# EAGLE design Audio panel Embedded Mega breakout (EAGLE 9.6.2)
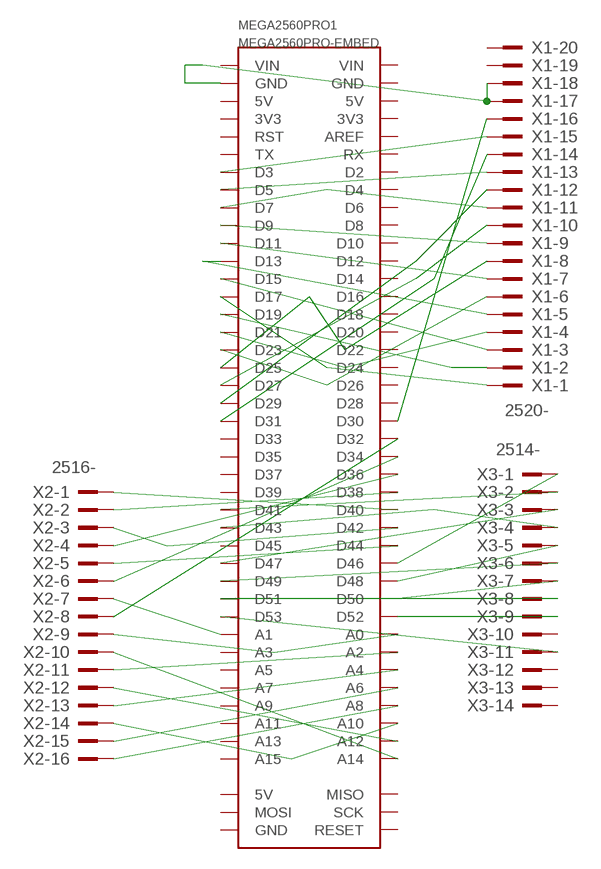
[diagram p0: schematic, sheet 1]

## Parts
MEGA2560PRO1  MEGA2560PRO-EMBED  [MEGA2560PRO-EMBED]
X1  2520-  [PAK100/2500-20]
X2  2516-  [PAK100/2500-16]
X3  2514-  [PAK100/2500-14]

## Nets
N$4: MEGA2560PRO1.D30 X1.16
N$5: MEGA2560PRO1.GND@1(GND) X1.17 X1.18
N$6: MEGA2560PRO1.D31 X1.14
N$7: MEGA2560PRO1.D29 X1.12
N$8: MEGA2560PRO1.D27 X1.10
N$9: MEGA2560PRO1.D25 X1.8
N$10: MEGA2560PRO1.D23 X1.6
N$11: MEGA2560PRO1.D21 X1.4
N$12: MEGA2560PRO1.D7 X1.11
N$13: MEGA2560PRO1.D19 X1.2
N$14: MEGA2560PRO1.D17 X1.1
N$15: MEGA2560PRO1.D15 X1.3
N$16: MEGA2560PRO1.D13 X1.5
N$17: MEGA2560PRO1.D11 X1.7
N$18: MEGA2560PRO1.D9 X1.9
N$19: MEGA2560PRO1.D5 X1.13
N$20: MEGA2560PRO1.D3 X1.15
N$21: MEGA2560PRO1.D38 X2.2
N$22: MEGA2560PRO1.D53 X3.11
N$23: MEGA2560PRO1.D52 X3.9
N$24: MEGA2560PRO1.D50 X3.7
N$25: MEGA2560PRO1.D48 X3.5
N$26: MEGA2560PRO1.D47 X3.3
N$27: MEGA2560PRO1.D46 X3.1
N$28: MEGA2560PRO1.D51 X3.8
N$29: MEGA2560PRO1.D49 X3.6
N$30: MEGA2560PRO1.D43 X3.4
N$31: MEGA2560PRO1.D41 X3.2
N$32: MEGA2560PRO1.D36 X2.4
N$33: MEGA2560PRO1.D34 X2.6
N$34: MEGA2560PRO1.D32 X2.8
N$35: MEGA2560PRO1.A14 X2.10
N$36: MEGA2560PRO1.A12 X2.12
N$37: MEGA2560PRO1.A10 X2.14
N$38: MEGA2560PRO1.A8 X2.16
N$39: MEGA2560PRO1.A6 X2.15
N$40: MEGA2560PRO1.A4 X2.13
N$41: MEGA2560PRO1.A2 X2.11
N$42: MEGA2560PRO1.A0 X2.9
N$43: MEGA2560PRO1.A1 X2.7
N$44: MEGA2560PRO1.D40 X2.1
N$45: MEGA2560PRO1.D42 X2.3
N$46: MEGA2560PRO1.D44 X2.5
Unconnected: MEGA2560PRO1.3V3@1(3V3) MEGA2560PRO1.3V3@2(3V3) MEGA2560PRO1.5V@1(5V) MEGA2560PRO1.5V@2(5V) MEGA2560PRO1.5V@3(5V) MEGA2560PRO1.A3 MEGA2560PRO1.A5 MEGA2560PRO1.A7 MEGA2560PRO1.A9 MEGA2560PRO1.A11 MEGA2560PRO1.A13 MEGA2560PRO1.A15 MEGA2560PRO1.AREF MEGA2560PRO1.D2 MEGA2560PRO1.D4 MEGA2560PRO1.D6 MEGA2560PRO1.D8 MEGA2560PRO1.D10 MEGA2560PRO1.D12 MEGA2560PRO1.D14 MEGA2560PRO1.D16 MEGA2560PRO1.D18 MEGA2560PRO1.D20 MEGA2560PRO1.D22 MEGA2560PRO1.D24 MEGA2560PRO1.D26 MEGA2560PRO1.D28 MEGA2560PRO1.D33 MEGA2560PRO1.D35 MEGA2560PRO1.D37 MEGA2560PRO1.D39 MEGA2560PRO1.D45 MEGA2560PRO1.GND@2(GND) MEGA2560PRO1.GND@3(GND) MEGA2560PRO1.MISO MEGA2560PRO1.MOSI MEGA2560PRO1.RESET MEGA2560PRO1.RST MEGA2560PRO1.RX MEGA2560PRO1.SCK MEGA2560PRO1.TX MEGA2560PRO1.VIN@1(VIN) MEGA2560PRO1.VIN@2(VIN) X1.19 X1.20 X3.10 X3.12 X3.13 X3.14

## Library data of the parts
MEGA2560PRO1 = robotdyn:MEGA2560PRO-EMBED: Robotdyn Robotdyn Mega 2560 PRO (Embed) https://robotdyn.com/mega-2560-pro-embed-ch340g-atmega2560-16au.html
X1 = con-3m:2520-: 3M (TM) Pak 100 4-Wall Header Source: 3M; OC_FARNELL: unknown; OC_NEWARK: unknown
X2 = con-3m:2516-: 3M (TM) Pak 100 4-Wall Header Source: 3M; OC_FARNELL: unknown; OC_NEWARK: unknown
X3 = con-3m:2514-: 3M (TM) Pak 100 4-Wall Header Source: 3M; OC_FARNELL: unknown; OC_NEWARK: unknown

## Board
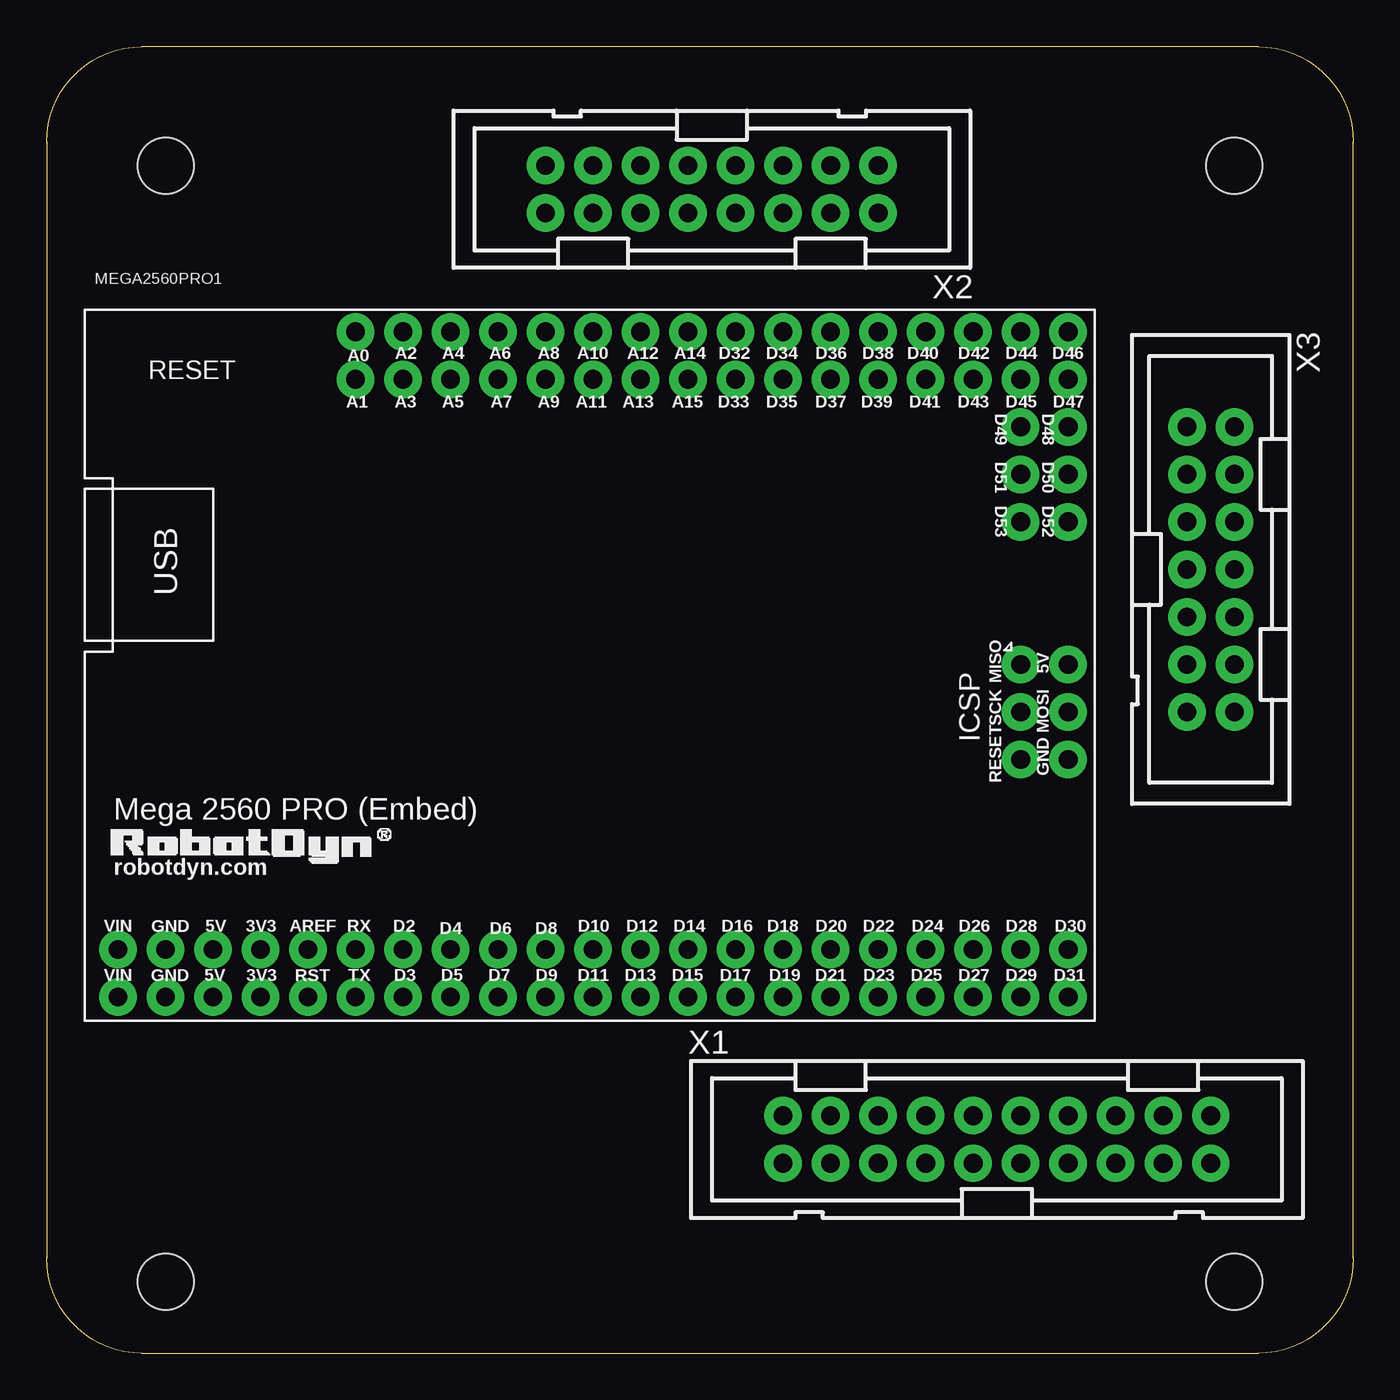
[diagram p1: board, top side]
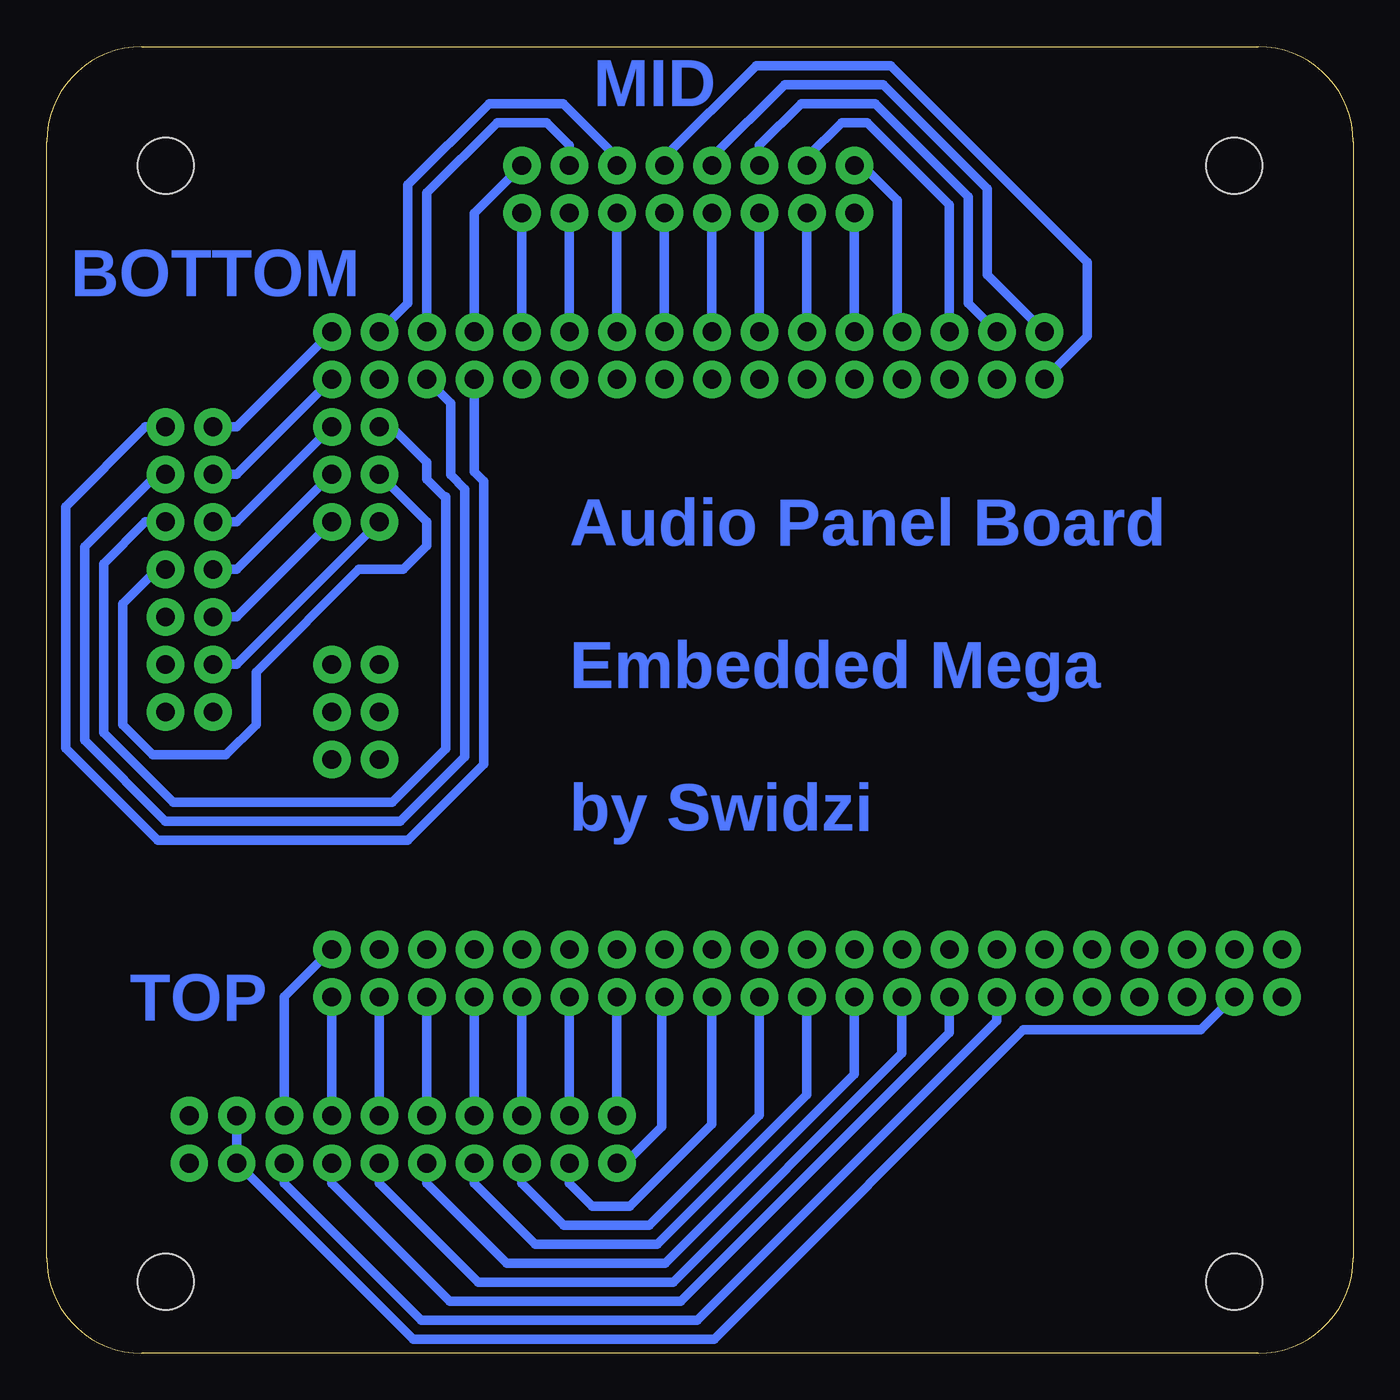
[diagram p2: board, bottom side, seen from below]

Size 69.85 x 69.85 mm. Coordinates in mm from the lower left corner, seen from the top.
Outline: 5.08,0 64.77,0 arc90 69.85,5.08 69.85,64.77 arc90 64.77,69.85 5.08,69.85 arc90 0,64.77 0,5.08 arc90 5.08,0
Copper layers (1*16): Top 0.035mm / dielectric 1.5mm / Bottom 0.035mm
Design rules "swidzi_milling_3018_tht_test": minimum track width 20mil, minimum drill 0.8mm, track to track 20mil, track to pad 20mil, pad to pad 20mil, via to via 6mil, smd to smd 6mil, copper to edge 15mil, drill to drill 6mil, minimum pad ring 10mil, minimum via ring 8mil, stop-mask expansion 4mil, vias tented up to drill 0mil, thermal gap 10mil
Holes 3 mm at 6.35,63.5 63.5,63.5 63.5,3.81 6.35,3.81

### Footprints (pad centres in the part's own frame; a part is rotated, then mirrored left to right if it is on the bottom)
MEGA2560PRO-EMBED = drill 1 pad 1.676: 3V3@1 -25.4,-19.05; 3V3@2 -25.4,-16.51; 5V@1 -27.94,-19.05; 5V@2 -27.94,-16.51; 5V@3 17.78,-1.27; A0 -20.32,16.51; A1 -20.32,13.97; A2 -17.78,16.51; A3 -17.78,13.97; A4 -15.24,16.51; A5 -15.24,13.97; A6 -12.7,16.51; A7 -12.7,13.97; A8 -10.16,16.51; A9 -10.16,13.97; A10 -7.62,16.51; A11 -7.62,13.97; A12 -5.08,16.51; A13 -5.08,13.97; A14 -2.54,16.51; A15 -2.54,13.97; AREF -22.86,-16.51; D2 -17.78,-16.51; D3 -17.78,-19.05; D4 -15.24,-16.51; D5 -15.24,-19.05; D6 -12.7,-16.51; D7 -12.7,-19.05; D8 -10.16,-16.51; D9 -10.16,-19.05; D10 -7.62,-16.51; D11 -7.62,-19.05; D12 -5.08,-16.51; D13 -5.08,-19.05; D14 -2.54,-16.51; D15 -2.54,-19.05; D16 0,-16.51; D17 0,-19.05; D18 2.54,-16.51; D19 2.54,-19.05; D20 5.08,-16.51; D21 5.08,-19.05; D22 7.62,-16.51; D23 7.62,-19.05; D24 10.16,-16.51; D25 10.16,-19.05; D26 12.7,-16.51; D27 12.7,-19.05; D28 15.24,-16.51; D29 15.24,-19.05; D30 17.78,-16.51; D31 17.78,-19.05; D32 0,16.51; D33 0,13.97; D34 2.54,16.51; D35 2.54,13.97; D36 5.08,16.51; D37 5.08,13.97; D38 7.62,16.51; D39 7.62,13.97; D40 10.16,16.51; D41 10.16,13.97; D42 12.7,16.51; D43 12.7,13.97; D44 15.24,16.51; D45 15.24,13.97; D46 17.78,16.51; D47 17.78,13.97; D48 17.78,11.43; D49 15.24,11.43; D50 17.78,8.89; D51 15.24,8.89; D52 17.78,6.35; D53 15.24,6.35; GND@1 -30.48,-19.05; GND@2 -30.48,-16.51; GND@3 17.78,-6.35; MISO 15.24,-1.27; MOSI 17.78,-3.81; RESET 15.24,-6.35; RST -22.86,-19.05; RX -20.32,-16.51; SCK 15.24,-3.81; TX -20.32,-19.05; VIN@1 -33.02,-19.05; VIN@2 -33.02,-16.51
PAK100/2500-20 = drill 1 pad 1.422: 1 -11.43,-1.27; 2 -11.43,1.27; 3 -8.89,-1.27; 4 -8.89,1.27; 5 -6.35,-1.27; 6 -6.35,1.27; 7 -3.81,-1.27; 8 -3.81,1.27; 9 -1.27,-1.27; 10 -1.27,1.27; 11 1.27,-1.27; 12 1.27,1.27; 13 3.81,-1.27; 14 3.81,1.27; 15 6.35,-1.27; 16 6.35,1.27; 17 8.89,-1.27; 18 8.89,1.27; 19 11.43,-1.27; 20 11.43,1.27
PAK100/2500-16 = drill 1 pad 1.422: 1 -8.89,-1.27; 2 -8.89,1.27; 3 -6.35,-1.27; 4 -6.35,1.27; 5 -3.81,-1.27; 6 -3.81,1.27; 7 -1.27,-1.27; 8 -1.27,1.27; 9 1.27,-1.27; 10 1.27,1.27; 11 3.81,-1.27; 12 3.81,1.27; 13 6.35,-1.27; 14 6.35,1.27; 15 8.89,-1.27; 16 8.89,1.27
PAK100/2500-14 = drill 1 pad 1.422: 1 -7.62,-1.27; 2 -7.62,1.27; 3 -5.08,-1.27; 4 -5.08,1.27; 5 -2.54,-1.27; 6 -2.54,1.27; 7 0,-1.27; 8 0,1.27; 9 2.54,-1.27; 10 2.54,1.27; 11 5.08,-1.27; 12 5.08,1.27; 13 7.62,-1.27; 14 7.62,1.27

### Placement (x,y rotation side)
MEGA2560PRO1  36.83,38.1 0 top
X1  50.8,11.43 0 top
X2  35.56,62.23 180 top
X3  62.23,41.91 270 top

### Tracks (layer width: path | path; a pad name or v marks a point on that pad's centre or on a via)
N$4
  Bottom 0.508: MEGA2560PRO1.D30 57.15,19.05 X1.16
N$5
  Bottom 0.508: X1.18 X1.17 59.67,10.16 50.26,0.75 34.17,0.75 17.64,17.29 8.16,17.29 6.4,19.05 MEGA2560PRO1.GND@1
N$6
  Bottom 0.508: X1.14 MEGA2560PRO1.D31
N$7
  Bottom 0.508: MEGA2560PRO1.D29 X1.12
N$8
  Bottom 0.508: X1.10 MEGA2560PRO1.D27
N$9
  Bottom 0.508: X1.8 MEGA2560PRO1.D25
N$10
  Bottom 0.508: MEGA2560PRO1.D23 X1.6
N$11
  Bottom 0.508: X1.4 MEGA2560PRO1.D21
N$12
  Bottom 0.508: X1.11 52.07,9.08 46.79,3.8 36.36,3.8 24.13,16.03 MEGA2560PRO1.D7
N$13
  Bottom 0.508: X1.2 MEGA2560PRO1.D19
N$14
  Bottom 0.508: X1.1 38.92,10.16 36.97,12.11 36.97,18.91 MEGA2560PRO1.D17
N$15
  Bottom 0.508: MEGA2560PRO1.D15 34.29,12.26 38.68,7.86 40.69,7.86 41.91,9.08 X1.3
N$16
  Bottom 0.508: MEGA2560PRO1.D13 31.75,12.72 37.63,6.85 42.22,6.85 44.45,9.08 X1.5
N$17
  Bottom 0.508: MEGA2560PRO1.D11 29.21,13.83 37.2,5.83 43.74,5.83 46.99,9.08 X1.7
N$18
  Bottom 0.508: MEGA2560PRO1.D9 26.67,14.93 36.78,4.82 45.27,4.82 49.53,9.08 X1.9
N$19
  Bottom 0.508: X1.13 54.61,9.08 48.31,2.78 35.94,2.78 21.59,17.14 MEGA2560PRO1.D5
N$20
  Bottom 0.508: MEGA2560PRO1.D3 19.05,17.78 35.06,1.77 49.84,1.77 57.15,9.08 X1.15
N$21
  Bottom 0.508: X2.2 MEGA2560PRO1.D38
N$22
  Bottom 0.508: X3.11 59.69,36.83 MEGA2560PRO1.D53
N$23
  Bottom 0.508: X3.9 59.69,39.37 MEGA2560PRO1.D52
N$24
  Bottom 0.508: X3.7 59.69,41.91 MEGA2560PRO1.D50
N$25
  Bottom 0.508: X3.5 59.69,44.45 MEGA2560PRO1.D48
N$26
  Bottom 0.508: X3.3 59.69,46.99 MEGA2560PRO1.D47
N$27
  Bottom 0.508: X3.1 59.69,49.53 MEGA2560PRO1.D46
N$28
  Bottom 0.508: X3.8 63.95,41.91 65.8,40.06 65.8,33.6 64.19,31.99 60.27,31.99 58.66,33.6 58.66,36.42 53.17,41.91 50.8,41.91 49.53,43.18 49.53,44.45 MEGA2560PRO1.D51
N$29
  Bottom 0.508: X3.6 64.58,44.45 66.81,42.22 66.81,33.18 63.09,29.45 51.38,29.45 48.51,32.32 48.51,45.72 | 52.26,49.53 MEGA2560PRO1.D49 51.44,49.53 49.53,47.62 49.53,46.74 48.51,45.72 | 48.51,45.78 48.51,45.72
N$30
  Bottom 0.508: X3.4 63.95,46.99 67.83,43.11 67.83,32.76 63.51,28.44 50.96,28.44 47.5,31.9 47.5,46.2 48.26,46.97 48.26,50.8 MEGA2560PRO1.D43
N$31
  Bottom 0.508: X3.2 64.58,49.53 68.84,45.27 68.84,32.34 63.93,27.42 50.54,27.42 46.48,31.48 46.48,46.63 46.99,47.13 MEGA2560PRO1.D41
N$32
  Bottom 0.508: MEGA2560PRO1.D36 X2.4
N$33
  Bottom 0.508: X2.6 MEGA2560PRO1.D34
N$34
  Bottom 0.508: MEGA2560PRO1.D32 X2.8
N$35
  Bottom 0.508: X2.10 MEGA2560PRO1.A14
N$36
  Bottom 0.508: MEGA2560PRO1.A12 X2.12
N$37
  Bottom 0.508: X2.14 MEGA2560PRO1.A10
N$38
  Bottom 0.508: MEGA2560PRO1.A8 X2.16
N$39
  Bottom 0.508: X2.15 26.23,63.5 24.37,61.65 24.37,54.85 MEGA2560PRO1.A6
N$40
  Bottom 0.508: MEGA2560PRO1.A4 21.59,61.41 25.98,65.8 27.36,65.8 29.21,63.95 X2.13
N$41
  Bottom 0.508: MEGA2560PRO1.A2 20.57,56.13 20.57,61.83 25.56,66.81 29.52,66.81 31.75,64.58 X2.11
N$42
  Bottom 0.508: MEGA2560PRO1.A0 19.56,57.66 19.56,62.25 25.14,67.83 30.41,67.83 34.29,63.95 X2.9
N$43
  Bottom 0.508: X2.7 36.83,63.95 31.93,68.84 24.72,68.84 14.21,58.34 14.21,54.37 MEGA2560PRO1.A1
N$44
  Bottom 0.508: X2.1 46.99,60.96 MEGA2560PRO1.D40
N$45
  Bottom 0.508: MEGA2560PRO1.D42 49.53,62.04 45.77,65.8 43.13,65.8 41.91,64.58 X2.3
N$46
  Bottom 0.508: MEGA2560PRO1.D44 50.55,56.13 50.55,62.46 46.19,66.81 42.24,66.81 39.37,63.95 X2.5

### Text on the board
Bottom: MID | BOTTOM | Audio Panel Board / / Embedded Mega / / by Swidzi | TOP